# Altium schematic sheet DC Step-Down Converter.SchDoc
size A4; Organization: Machine Intelligence Laboratory; SheetNumber: 4; SheetTotal: 5; Des1: This steps down the ~22V; Des2: from the battery to 5V for use; Des3: with PCB electronics.; Author1: Russell MacGregor; VersionControl_Repository: BatteryMonitorSpring2025
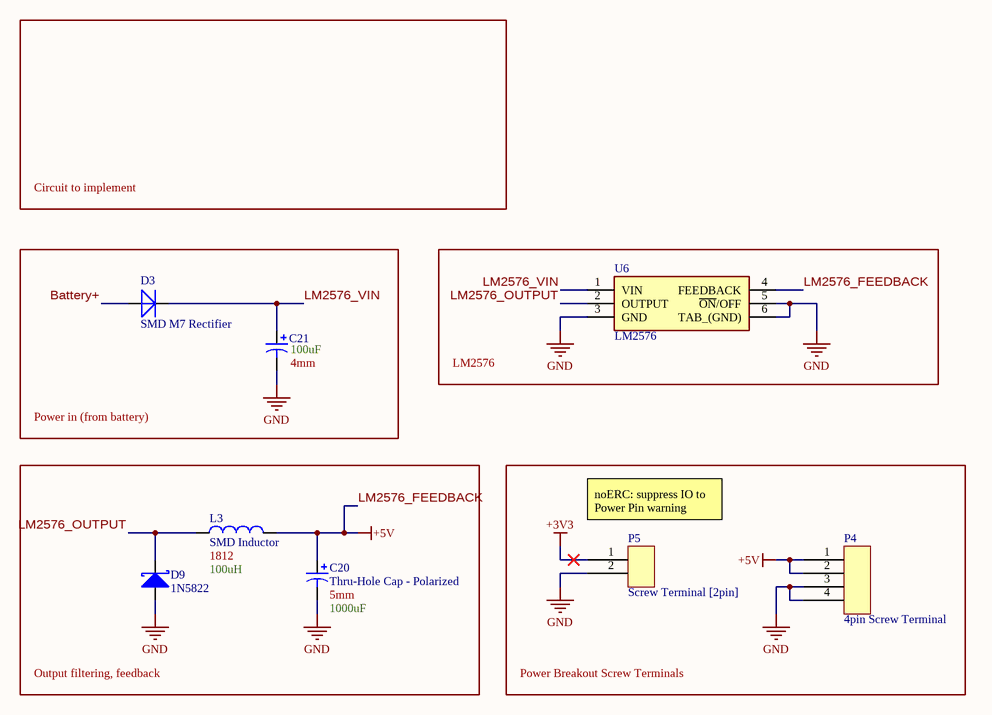
[diagram p0: DC Step-Down Converter.SchDoc]

## Parts
C20  Thru-Hole Cap - Polarized  Pin Spacing: 5mm  Capacitance: 1000uF  [Thru-Hole Polarized Cap [3.5mm]]
C21  Capacitance: 100uF  Diameter: 4mm  [SMD Cap - Polarized, 4mm]  (hidden comment: SMD Cap - Polarized)
D3  SMD M7 Rectifier  [SMD M7 Rectifier]
D9  1N5822  [1N5822 Schottky Diode]
L3  SMD Inductor  Size Package: 1812  Inductance: 100uH  [SMD Inductor [1812]]
P4  4pin Screw Terminal  [Screw Terminal [4pin]]
P5  Screw Terminal [2pin]  [Screw Terminal [2pin]]
U6  LM2576  [LM2576 Step Down Converter]

## Blocks framed on the sheet
Power in (from battery): C21 D3
LM2576: U6
Output filtering, feedback: C20 D9 L3
Power Breakout Screw Terminals: P4 P5

## Nets
+3V3: P5.1
GND: C20.2 C21.2 D9.2(A) P4.3 P4.4 P5.2 U6.3(GND) U6.5(~{ON}/OFF) U6.6(TAB_(GND))
LM2576_FEEDBACK: C20.1 L3.2 P4.1 P4.2 U6.4(FEEDBACK)  [also labelled +5V]
Battery+: D3.A
LM2576_OUTPUT: D9.1(K) L3.1 U6.2(OUTPUT)
LM2576_VIN: C21.1 D3.C U6.1(VIN)

## Notes on the sheet
- Circuit to implement
- (near P5) noERC: suppress IO to Power Pin warning
- Project/Vehicle:
- Author(s):
- -
- Revisor(s):
- Git Repo:
- Git Hash:
- Date:
- Revision:
- Size:
- A4
- File:
- Sheet
- of

## Library data of the parts
C21 = SMD Cap - Polarized: Diameter: 4mm; JLC Part #: *; Mouser Part #: 667-EEE-FT0J101AR
D3 = SMD M7 Rectifier: JLC Part #: C95872
D9 = 1N5822 Schottky Diode: Mouser Part #: 511-1N5822
P4 = Screw Terminal [4pin]
U6 = LM2576 Step Down Converter
C20 = Thru-Hole Cap - Polarized: JLC Part #: *; Mouser Part #: 594-MAL214236102E3
L3 = SMD Inductor: JLC Part #: *; Mouser Part #: 70-ISC1812ER101J